# EAGLE schematic WiseClock4 (EAGLE 7.1.0)
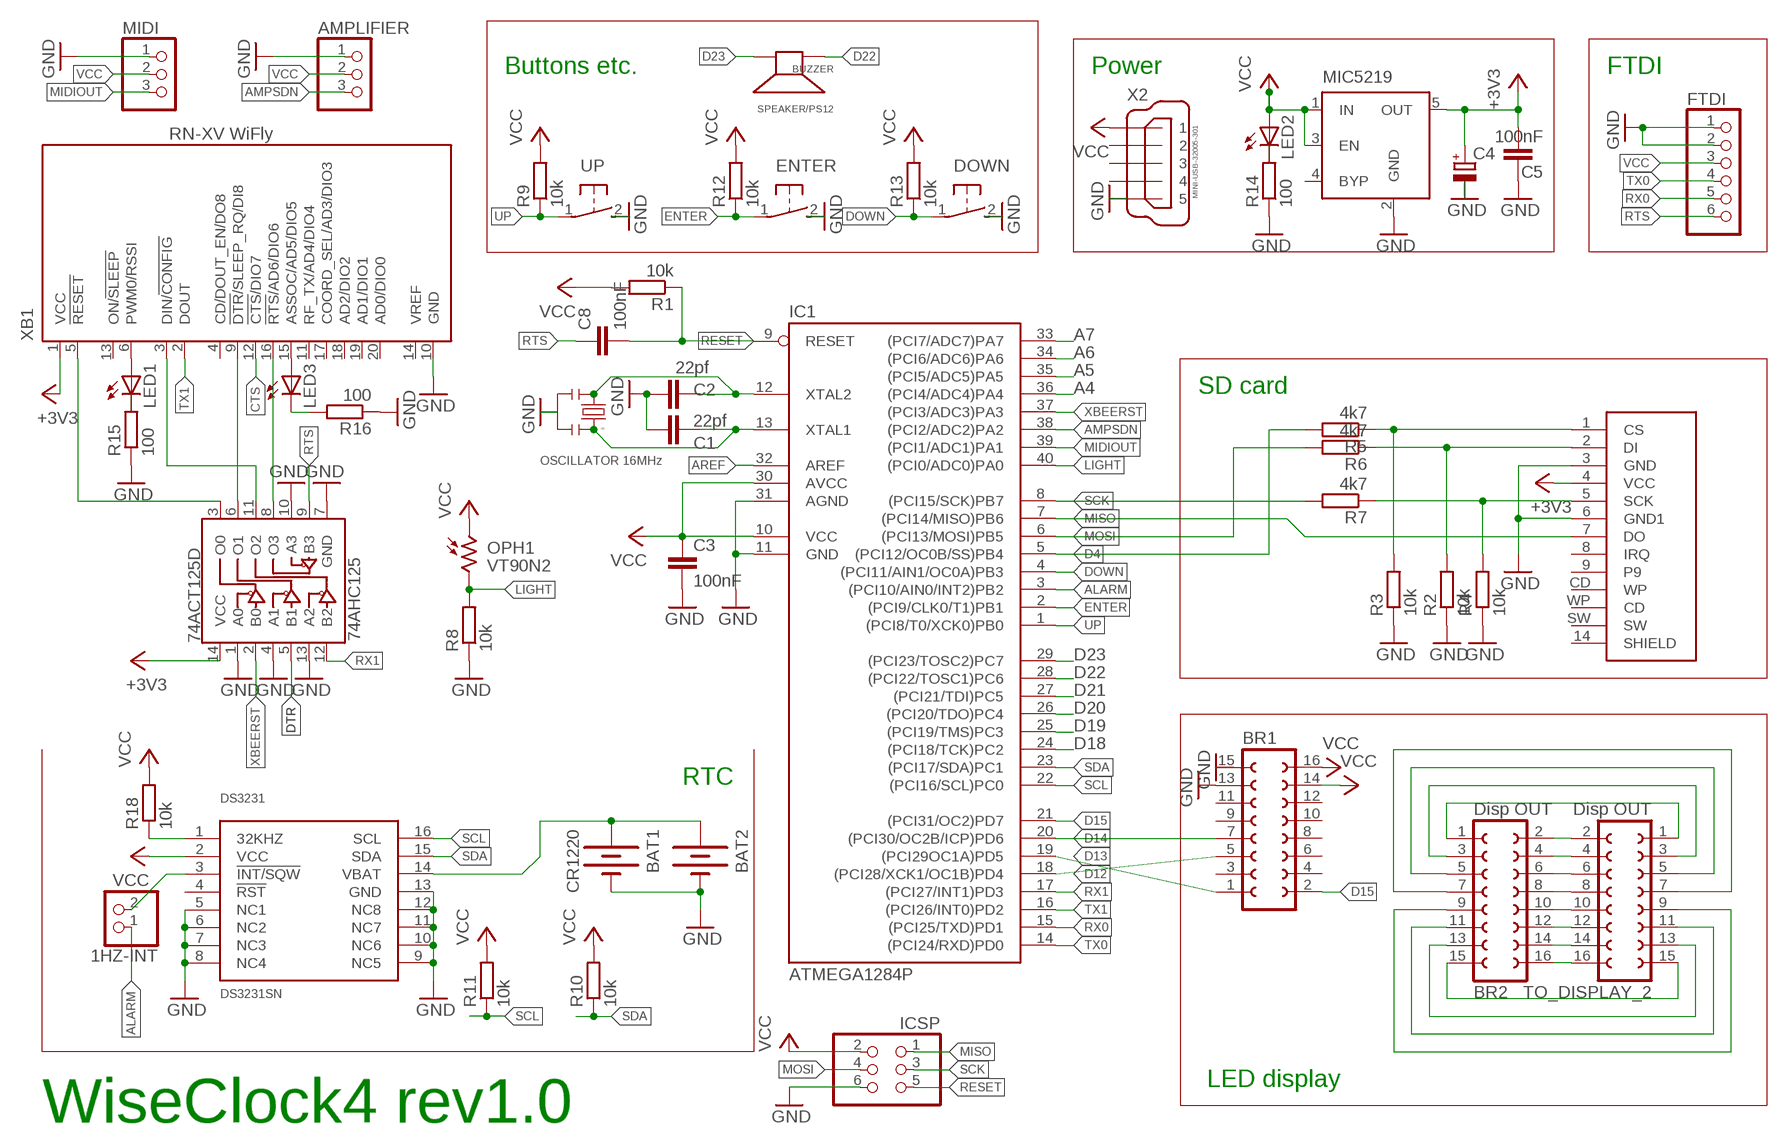
[diagram p0: schematic, sheet 1]

## Parts
1HZ-INT  PINHD-1X2  [1X02]
74AHC125  74ACT125D  [SO014]
AMPLIFIER  PINHD-1X3  [1X03]
BAT1  CR1220  BATTERYBAT_CR1220  [BAT_CR1220]
BAT2  BATTERY12MM  [BATTCON_12MM]
BR1  LED display  FE08-2  [FE08-2]
BR2  Disp OUT  FE08-2  [FE08-2]
BUZZER  SPEAKER/PS12  [PS12]
C1  22pf  C-EU025-024X044  [C025-024X044]
C2  22pf  C-EU025-024X044  [C025-024X044]
C3  100nF  C-EU050-024X044  [C050-024X044]
C4  CPOL-EUTT2D4L  [TT2D4L]
C5  100nF  C-EU050-024X044  [C050-024X044]
C8  100nF  C-EU050-024X044  [C050-024X044]
DOWN  31-XX  [B3F-31XX]
DS3231  DS3231SN  [SO16W]
ENTER  31-XX  [B3F-31XX]
FTDI  PINHD-1X6  [1X06]
IC1  ATMEGA1284P  [DIL40]
ICSP  PINHD-2X3  [2X03]
LED1  LEDCHIPLED_1206  [CHIPLED_1206]
LED2  LEDCHIPLED_1206  [CHIPLED_1206]
LED3  LEDCHIPLED_1206  [CHIPLED_1206]
MIC5219  MIC5219XX  [SOT23-5]
MIDI  PINHD-1X3  [1X03]
OPH1  VT90N2  [VT900]
R1  10k  R-EU_0204/7  [0204/7]
R2  10k  R-EU_0204/7  [0204/7]
R3  10k  R-EU_0204/7  [0204/7]
R4  10k  R-EU_0204/7  [0204/7]
R5  4k7  R-EU_0204/7  [0204/7]
R6  4k7  R-EU_0204/7  [0204/7]
R7  4k7  R-EU_0204/7  [0204/7]
R8  10k  R-EU_0204/7  [0204/7]
R9  10k  R-EU_0204/7  [0204/7]
R10  10k  R-EU_0204/7  [0204/7]
R11  10k  R-EU_0204/7  [0204/7]
R12  10k  R-EU_0204/7  [0204/7]
R13  10k  R-EU_0204/7  [0204/7]
R14  100  R-EU_M0805  [M0805]
R15  100  R-EU_M0805  [M0805]
R16  100  R-EU_M0805  [M0805]
R18  10k  R-EU_0204/7  [0204/7]
SDCARD  SD_CARD_SOCKETSD  [SD-MMC_SOCKET-PP]
TO_DISPLAY_2  Disp OUT  FE08-2  [FE08-2]
U$1  OSCILLATOR 16MHz  RESONATORPTH  [RESONATOR-PTH]
UP  31-XX  [B3F-31XX]
X2  MINI-USB-32005-301  [32005-301]
XB1  RN-XV WiFly  XBEE-PRO  [XBEE-PRO]

## Nets
+3V3: 74AHC125.14(VCC) C4.+ C5.2 MIC5219.5(OUT) SDCARD.4(VCC) XB1.1(VCC)
A4: IC1.36((PCI4/ADC4)PA4)
A5: IC1.35((PCI5/ADC5)PA5)
A6: IC1.34((PCI6/ADC6)PA6)
A7: IC1.33((PCI7/ADC7)PA7)
ALARM: 1HZ-INT.1 IC1.3((PCI10/AIN0/INT2)PB2)
AMPSDN: AMPLIFIER.3 IC1.38((PCI2/ADC2)PA2)
AREF: IC1.32(AREF)
CTS: XB1.12(!CTS!/DIO7)
D4: IC1.5((PCI12/OC0B/SS)PB4) R5.2
D12: BR1.5 IC1.18((PCI28/XCK1/OC1B)PD4)
D13: BR1.1 IC1.19((PCI29OC1A)PD5)
D14: BR1.7 IC1.20((PCI30/OC2B/ICP)PD6)
D15: BR1.2 IC1.21((PCI31/OC2)PD7)
D18: IC1.24((PCI18/TCK)PC2)
D19: IC1.25((PCI19/TMS)PC3)
D20: IC1.26((PCI20/TDO)PC4)
D21: IC1.27((PCI21/TDI)PC5)
D22: BUZZER.P$1(+) IC1.28((PCI22/TOSC1)PC6)
D23: BUZZER.P$2(-) IC1.29((PCI23/TOSC2)PC7)
DOWN: DOWN.1(P) IC1.4((PCI11/AIN1/OC0A)PB3) R13.1
DTR: 74AHC125.5(B1)
ENTER: ENTER.1(P) IC1.2((PCI9/CLK0/T1)PB1) R12.1
GND: 74AHC125.1(A0) 74AHC125.4(A1) 74AHC125.7(GND) 74AHC125.10(A3) 74AHC125.13(A2) AMPLIFIER.1 BAT1.GND(-) BAT2.GND(-) BR1.13 BR1.15 C1.1 C2.1 C3.2 C4.- C5.1 DOWN.2(S) DS3231.5(NC1) DS3231.6(NC2) DS3231.7(NC3) DS3231.8(NC4) DS3231.9(NC5) DS3231.10(NC6) DS3231.11(NC7) DS3231.12(NC8) DS3231.13(GND) ENTER.2(S) FTDI.1 FTDI.2 IC1.11(GND) IC1.31(AGND) ICSP.6 MIC5219.2(GND) MIDI.1 R2.1 R3.1 R4.1 R8.1 R14.1 R15.1 R16.1 SDCARD.3(GND) SDCARD.6(GND1) U$1.2 UP.2(S) X2.5 XB1.10(GND)
LIGHT: IC1.40((PCI0/ADC0)PA0) OPH1.2 R8.2
MIDIOUT: IC1.39((PCI1/ADC1)PA1) MIDI.3
MISO: IC1.7((PCI14/MISO)PB6) ICSP.1 SDCARD.7(DO)
MOSI: IC1.6((PCI13/MOSI)PB5) ICSP.4 R6.2
N$1: C2.2 IC1.12(XTAL2) U$1.1
N$3: DS3231.1(32KHZ) R18.1
N$4: BR2.2 TO_DISPLAY_2.2
N$5: C1.2 IC1.13(XTAL1) U$1.3
N$6: R2.2 R6.1 SDCARD.2(DI)
N$7: R4.2 R7.1 SDCARD.5(SCK)
N$8: BR2.4 TO_DISPLAY_2.4
N$9: BR2.6 TO_DISPLAY_2.6
N$10: BR2.8 TO_DISPLAY_2.8
N$11: BR2.10 TO_DISPLAY_2.10
N$12: BR2.12 TO_DISPLAY_2.12
N$13: BR2.14 TO_DISPLAY_2.14
N$14: BR2.16 TO_DISPLAY_2.16
N$15: BR2.15 TO_DISPLAY_2.15
N$16: BR2.13 TO_DISPLAY_2.13
N$17: BR2.11 TO_DISPLAY_2.11
N$18: BR2.9 TO_DISPLAY_2.9
N$19: BR2.1 TO_DISPLAY_2.1
N$20: BR2.3 TO_DISPLAY_2.3
N$21: BR2.5 TO_DISPLAY_2.5
N$22: BR2.7 TO_DISPLAY_2.7
N$23: 74AHC125.8(O3) XB1.16(!RTS!/AD6/DIO6)
N$24: R3.2 R5.1 SDCARD.1(CS)
N$25: LED3.C R16.2
N$26: LED1.C R15.2
N$27: 74AHC125.11(O2) XB1.3(DIN/!CONFIG)
N$28: 74AHC125.3(O0) XB1.5(!RESET)
N$29: LED1.A XB1.6(PWM0/RSSI)
N$30: LED2.C R14.2
N$31: 74AHC125.6(O1) XB1.9(!DTR!/SLEEP_RQ/DI8)
N$32: LED3.A XB1.15(ASSOC/AD5/DIO5)
N$33: BAT1.V+(+) BAT2.PWR@1(+) DS3231.14(VBAT)
N$34: 1HZ-INT.2 DS3231.3(!INT/SQW)
RESET: C8.2 IC1.9(RESET) ICSP.5 R1.1
RTS: 74AHC125.9(B3) C8.1 FTDI.6
RX0: FTDI.5 IC1.15((PCI25/TXD)PD1)
RX1: 74AHC125.12(B2) IC1.17((PCI27/INT1)PD3)
SCK: IC1.8((PCI15/SCK)PB7) ICSP.3 R7.2
SCL: DS3231.16(SCL) IC1.22((PCI16/SCL)PC0) R11.1
SDA: DS3231.15(SDA) IC1.23((PCI17/SDA)PC1) R10.1
TX0: FTDI.4 IC1.14((PCI24/RXD)PD0)
TX1: IC1.16((PCI26/INT0)PD2) XB1.2(DOUT)
UP: IC1.1((PCI8/T0/XCK0)PB0) R9.1 UP.1(P)
VCC [power]: AMPLIFIER.2 BR1.14 BR1.16 C3.1 DS3231.2(VCC) FTDI.3 IC1.10(VCC) IC1.30(AVCC) ICSP.2 LED2.A MIC5219.1(IN) MIC5219.3(EN) MIDI.2 OPH1.1 R1.2 R9.2 R10.2 R11.2 R12.2 R13.2 R18.2 X2.1
XBEERST: 74AHC125.2(B0) IC1.37((PCI3/ADC3)PA3)
Unconnected: BR1.3 BR1.4 BR1.6 BR1.8 BR1.9 BR1.10 BR1.11 BR1.12 DS3231.4(!RST) MIC5219.4(BYP) SDCARD.8(IRQ) SDCARD.9 SDCARD.14(SHIELD) SDCARD.CD(WP) SDCARD.SW SDCARD.WP(CD) X2.2 X2.3 X2.4 XB1.4(CD/DOUT_EN/DO8) XB1.11(RF_TX/AD4/DIO4) XB1.13(ON/!SLEEP) XB1.14(VREF) XB1.17(COORD_SEL/AD3/DIO3) XB1.18(AD2/DIO2) XB1.19(AD1/DIO1) XB1.20(AD0/DIO0)

## Notes on the sheet
- Buttons etc. | Power | FTDI
- SD card
- RTC
- WiseClock4 rev1.0

## Library data of the parts
1HZ-INT = pinhead:PINHD-1X2: PIN HEADER
74AHC125 = SparkFun:74ACT125D: Quad Buffer with 3-State Outputs- ON Semi Conductor: Digikey P/N MC74ACT125DR2GOSTR-ND
AMPLIFIER MIDI = pinhead:PINHD-1X3: PIN HEADER
BAT1 = SparkFun:BATTERY: Battery Holders Various common sizes : AA, AAA, 20mm coin cell and 12mm coin cell.
BAT2 = SparkFun6:BATTERY: Battery Holders Various common sizes : AA, AAA, 20mm coin cell and 12mm coin cell.
BR1 BR2 TO_DISPLAY_2 = con-lsta:FE08-2: FEMALE HEADER
BUZZER = ybox2:SPEAKER: SPEAKER Source: Buerklin
C1-C3 C5 C8 = rcl:C-EU: CAPACITOR, European symbol
C4 = rcl:CPOL-EU: POLARIZED CAPACITOR, European symbol
DOWN ENTER UP = switch-omron:31-XX: OMRON SWITCH
DS3231 = comfile:DS3231SN
FTDI = pinhead:PINHD-1X6: PIN HEADER
IC1 = avr:ATMEGA1284P: MICROCONTROLLER 128 kBytes FLASH 16 kBytes SRAM 4 kBytes EEPROM DUAL USART 8-channel 10 bit ADC
ICSP = pinhead:PINHD-2X3: PIN HEADER
LED1-LED3 = led:LED: LED OSRAM: - CHIPLED LG R971, LG N971, LY N971, LG Q971, LY Q971, LO R971, LY R971 LH N974, LH R974 LS Q976, LO Q976, LY Q976 LO Q996 - Hyper CHIPLED LW Q18S LB Q993, LB Q99A, LB R99A - SideLED LS A670, LO A670, LY A670, LG A670, LP A670 LB A673, LV A673, LT A673, LW A673 LH A674 LY A675 LS A676, LA A676, LO A676, LY A676, LW A676 LS A679, LY A679, LG A679 - Hyper Micro SIDELED® LS Y876, LA Y876, LO Y876, LY Y876 LT Y87S - SmartLED LW L88C, LW L88S LB L89C, LB L89S, LG L890 LS L89K, LO L89K, LY L89K LS L896, LA L896, LO L896, LY L896 - TOPLED LS T670, LO T670, LY T670, LG T670, LP T670 LSG T670, LSP T670, LSY T670, LOP T670, LYG T670 LG T671, LOG T671, LSG T671 LB T673, LV T673, LT T673, LW T673 LH T674 LS T676, LA T676, LO T676, LY T676, LB T676, LH T676, LSB T676, LW T676 LB T67C, LV T67C, LT T67C, LS T67K, LO T67K, LY T67K, LW E67C LS E67B, LA E67B, LO E67B, LY E67B, LB E67C, LV E67C, LT E67C LW T67C LS T679, LY T679, LG T679 LS T770, LO T770, LY T770, LG T770, LP T770 LB T773, LV T773, LT T773, LW T773 LH T774 LS E675, LA E675, LY E675, LS T675 LS T776, LA T776, LO T776, LY T776, LB T776 LHGB T686 LT T68C, LB T68C - Hyper Mini TOPLED® LB M676 - Mini TOPLED Santana® LG M470 LS M47K, LO M47K, LY M47K Source: http://www.osram.convergy.de LUXEON: - LUMILED® LXK2-PW12-R00, LXK2-PW12-S00, LXK2-PW14-U00, LXK2-PW14-V00 LXK2-PM12-R00, LXK2-PM12-S00, LXK2-PM14-U00 LXK2-PE12-Q00, LXK2-PE12-R00, LXK2-PE12-S00, LXK2-PE14-T00, LXK2-PE14-U00 LXK2-PB12-K00, LXK2-PB12-L00, LXK2-PB12-M00, LXK2-PB14-N00, LXK2-PB14-P00, LXK2-PB14-Q00 LXK2-PR12-L00, LXK2-PR12-M00, LXK2-PR14-Q00, LXK2-PR14-R00 LXK2-PD12-Q00, LXK2-PD12-R00, LXK2-PD12-S00 LXK2-PH12-R00, LXK2-PH12-S00 LXK2-PL12-P00, LXK2-PL12-Q00, LXK2-PL12-R00 Source: www.luxeon.com KINGBRIGHT: KA-3528ASYC Source: www.kingbright.com
MIC5219 = v-reg-micrel:MIC5219XX: VOLTAGE REGULATOR
OPH1 = photo-elements:VT9: Photoconductive Cell VT900 Series Source: http://optoelectronics.perkinelmer.com/content/Datasheets/DTS_vt900seriesdatasheet.pdf
R1-R16 R18 = rcl:R-EU_: RESISTOR, European symbol
SDCARD = SparkFun:SD_CARD_SOCKET: SD/MMC Socket Media socket for SD and MMC cards. Push-push type. Schematic element and footprint production proven. Spark Fun Electronics SKU : PRT-00136
U$1 = SparkFun:RESONATOR: Resonator Small SMD resonator. This is the itty bitty 10/20MHz resonators with built in caps. CSTCE10M0G55 and CSTCE20M0V53. Footprint has been reviewed closely but hasn't been tested yet.
X2 = con-cypressindustries:MINI-USB-: MINI USB-B Conector Source: www.cypressindustries.com
XB1 = maxstream:XBEE: XBee (TM) /XBee-PRO(TM) OEM RF Modules Source: MaxStream, Inc. xbee_productmanual.pdf